# Altium schematic sheet FanControl.SchDoc
size A4; SheetNumber: 8; SheetTotal: 9
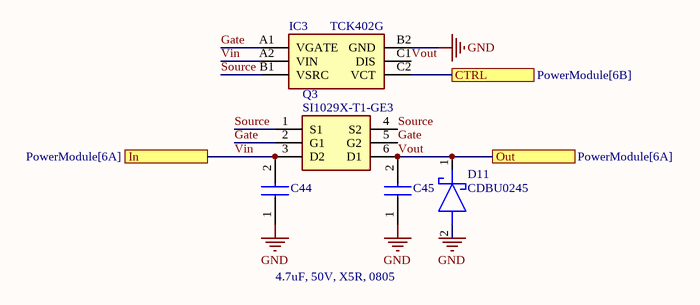
[diagram p0: FanControl.SchDoc]

## Parts
C44  4.7uF, 50V, X5R, 0805  [CAPC2012X145N]  (value not drawn)
C45  4.7uF, 50V, X5R, 0805  [CAPC2012X145N]  (value not drawn)
D11  CDBU0245  [DIOC1709X85N]
IC3  TCK402G  [BGA6C40P2X3_80X120X59]
Q3  SI1029X-T1-GE3  [SOTFL50P160X60-6N]

## Ports
CTRL (see PowerModule[6B]), In (see PowerModule[6A]), Out (see PowerModule[6A])

## Nets
GND: C44.1 C45.1 D11.2(A) IC3.B2(GND)
CTRL: IC3.C2(VCT) ; port CTRL
Gate: IC3.A1(VGATE) Q3.2(G1) Q3.5(G2)
Source: IC3.B1(VSRC) Q3.1(S1) Q3.4(S2)
Vin: C44.2 IC3.A2(VIN) Q3.3(D2) ; port In
Vout: C45.2 D11.1(K) IC3.C1(DIS) Q3.6(D1) ; port Out

## Notes on the sheet
- 4.7uF, 50V, X5R, 0805

## Library data of the parts
C44 C45 = GRM21BR61H475ME51L: Capacitor; Manufacturer_Name: Murata Electronics; Datasheet Link: https://search.murata.co.jp/Ceramy/image/img/A01X/G101/ENG/GRM21BR61H475ME51-01A.pdf; Height: 1.45mm; Manufacturer_Part_Number: GRM21BR61H475ME51L; Mouser Part Number: 81-GRM21BR61H475M51L; Mouser Price/Stock: https://www.mouser.co.uk/ProductDetail/Murata-Electronics/GRM21BR61H475ME51L?qs=eeBpzGFlv%252B%2Fg0wAeHy0eJw%3D%3D; Arrow Part Number: GRM21BR61H475ME51L; Arrow Price/Stock: https://www.arrow.com/en/products/grm21br61h475me51l/murata-manufacturing?region=nac
D11 = CDBU0245: Schottky Diode; Manufacturer_Name: Comchip Technology; Datasheet Link: https://componentsearchengine.com/Datasheets/1/CDBU0245.pdf; Height: 0.85mm; Manufacturer_Part_Number: CDBU0245; Mouser Part Number: 750-CDBU0245; Mouser Price/Stock: https://www.mouser.co.uk/ProductDetail/Comchip-Technology/CDBU0245?qs=tw%252BuQ%2FB6PO2XscGM2Q%2FbYQ%3D%3D; Arrow Part Number: CDBU0245; Arrow Price/Stock: https://www.arrow.com/en/products/cdbu0245/comchip-technology?utm_currency=USD&region=nac
IC3 = TCK402G: Integrated Circuit; Manufacturer_Name: Toshiba; Datasheet Link: https://toshiba.semicon-storage.com/info/docget.jsp?did=59174&prodName=TCK402G; Height: 0.59mm; Manufacturer_Part_Number: TCK402G
Q3 = SI1029X-T1-GE3: Transistor; Manufacturer_Name: Vishay; Datasheet Link: https://www.vishay.com/docs/71435/71435.pdf; Height: 0.6mm; Manufacturer_Part_Number: SI1029X-T1-GE3; Mouser Part Number: 781-SI1029X-T1-GE3; Mouser Price/Stock: https://www.mouser.co.uk/ProductDetail/Vishay-Semiconductors/SI1029X-T1-GE3?qs=tWM4QuTcS4WFBF4Fada7Qg%3D%3D